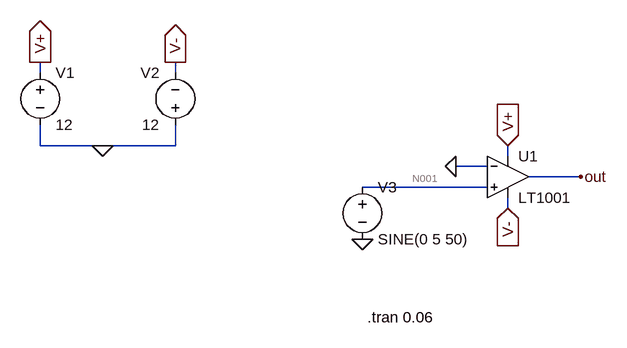
[diagram p0: schematic Simple comparator.asc]
Simple comparator.asc, the LTspice schematic file:
Version 4
SHEET 1 880 680
WIRE -576 -16 -576 -32
WIRE -368 -16 -368 -32
WIRE -576 96 -576 64
WIRE -480 96 -576 96
WIRE -368 96 -368 64
WIRE -368 96 -480 96
WIRE 144 112 144 96
WIRE 112 128 64 128
WIRE 256 144 176 144
WIRE 112 160 -80 160
WIRE 144 192 144 176
FLAG -576 -32 V+
IOPIN -576 -32 Out
FLAG -368 -32 V-
IOPIN -368 -32 Out
FLAG -480 96 0
FLAG 144 96 V+
IOPIN 144 96 In
FLAG 144 192 V-
IOPIN 144 192 In
FLAG -80 240 0
FLAG 64 128 0
FLAG 256 144 out
SYMBOL voltage -576 -32 R0
WINDOW 123 0 0 Left 0
WINDOW 39 0 0 Left 0
SYMATTR InstName V1
SYMATTR Value 12
SYMBOL voltage -368 80 R180
WINDOW 0 24 96 Left 2
WINDOW 3 24 16 Left 2
WINDOW 123 0 0 Left 0
WINDOW 39 0 0 Left 0
SYMATTR InstName V2
SYMATTR Value 12
SYMBOL voltage -80 144 R0
WINDOW 123 24 124 Left 2
WINDOW 39 0 0 Left 0
SYMATTR InstName V3
SYMATTR Value SINE(0 5 50)
SYMBOL OpAmps\\LT1001 144 80 R0
SYMATTR InstName U1
TEXT -72 360 Left 2 !.tran 0.06

The netlist it stands for:
* Simple comparator.asc
V1 V+ 0 12
V2 0 V- 12
V3 N001 0 SINE(0 5 50)
XU1 N001 0 V+ V- out LT1001  ; pins In+ In- V+ V- OUT
.tran 0.06
.lib LTC.lib
.backanno
.end

* Results of the author's LTspice run, read from the files saved beside the schematic
* Operating Point, zero values left out:
*   V(v+) = 12 V
*   V(v-) = -12 V
*   I(V2) = -2.25 mA
*   I(V1) = -2.25 mA
*   Ix(u1:3) = 2.25 mA
*   Ix(u1:4) = -2.25 mA
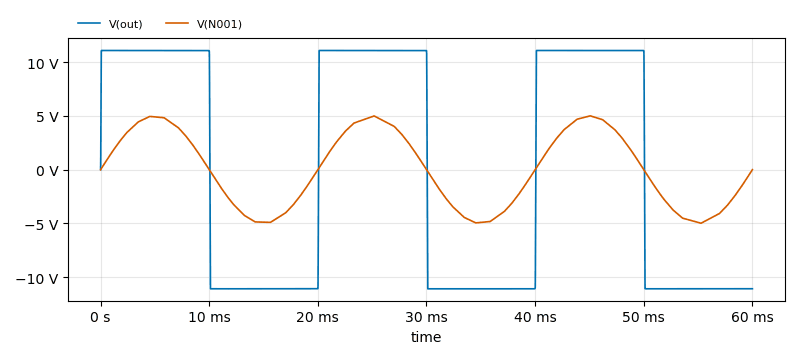
[diagram p1: Transient Analysis of Simple comparator.asc, plotted from the saved traces]
* Transient Analysis, 1 run:
*   V(out): min -11.07 V, max 11.08 V, average 17.37 mV, rms 11.04 V, last -11.06 V
*   V(N001): min -4.979 V, max 4.999 V, average -915.5 µV, rms 3.5 V, last 0 V